# EAGLE schematic easy_bee_counter (EAGLE 9.4.2)
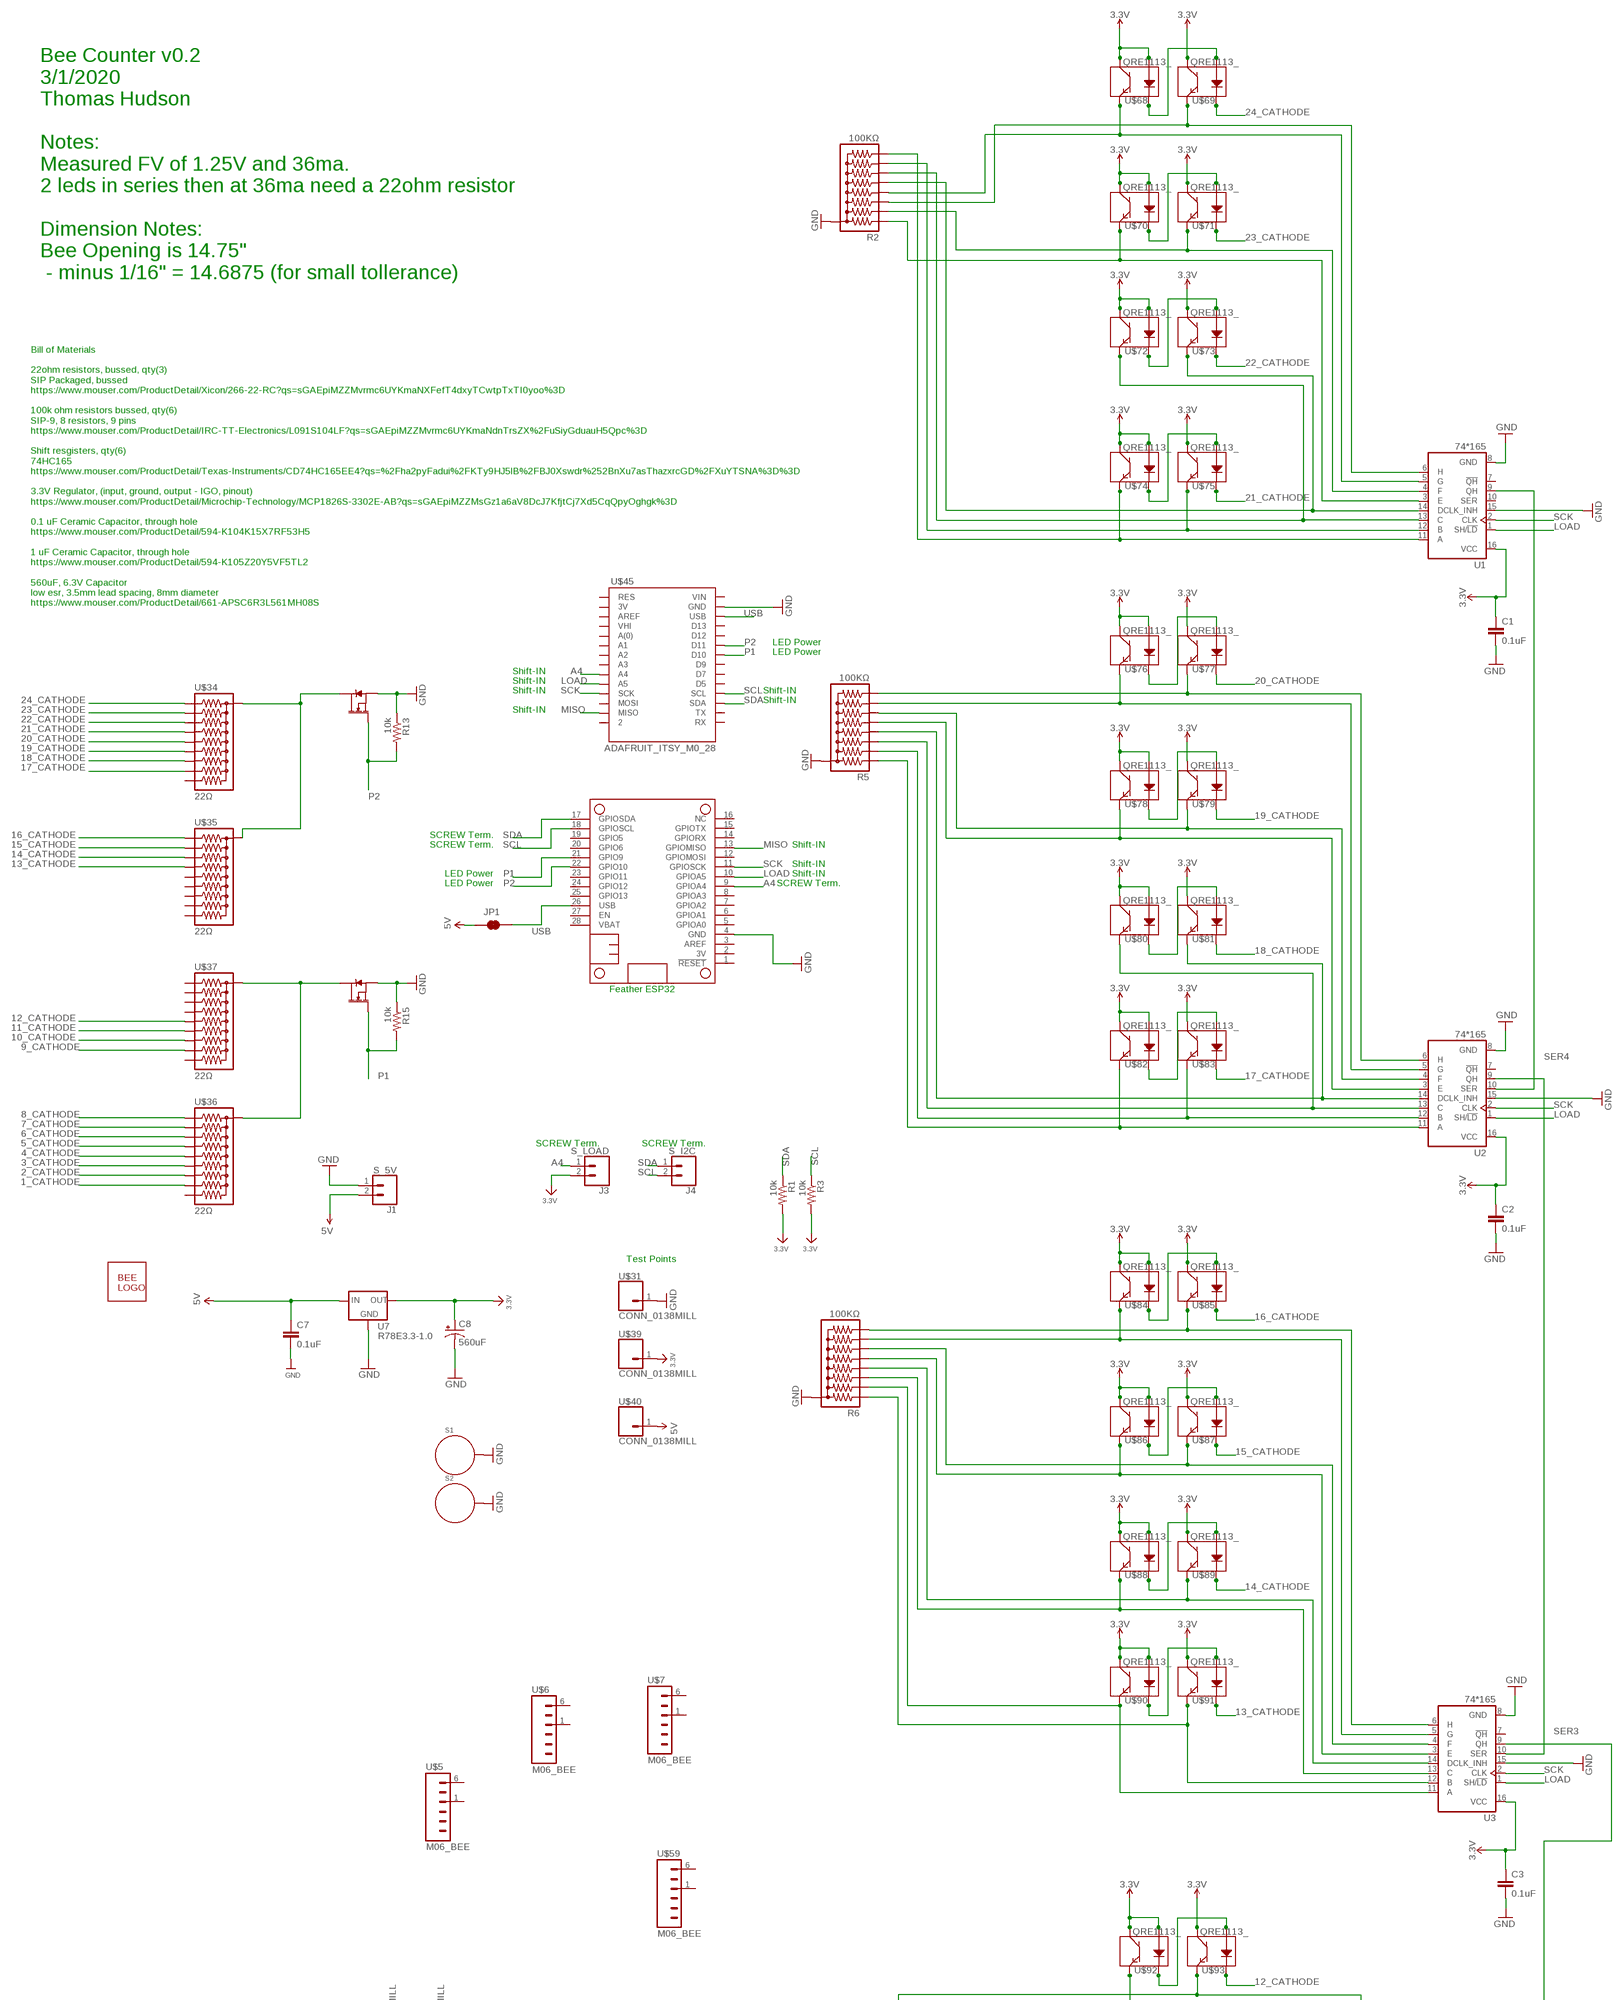
[diagram p0: schematic, sheet 1, part 1 of 2]
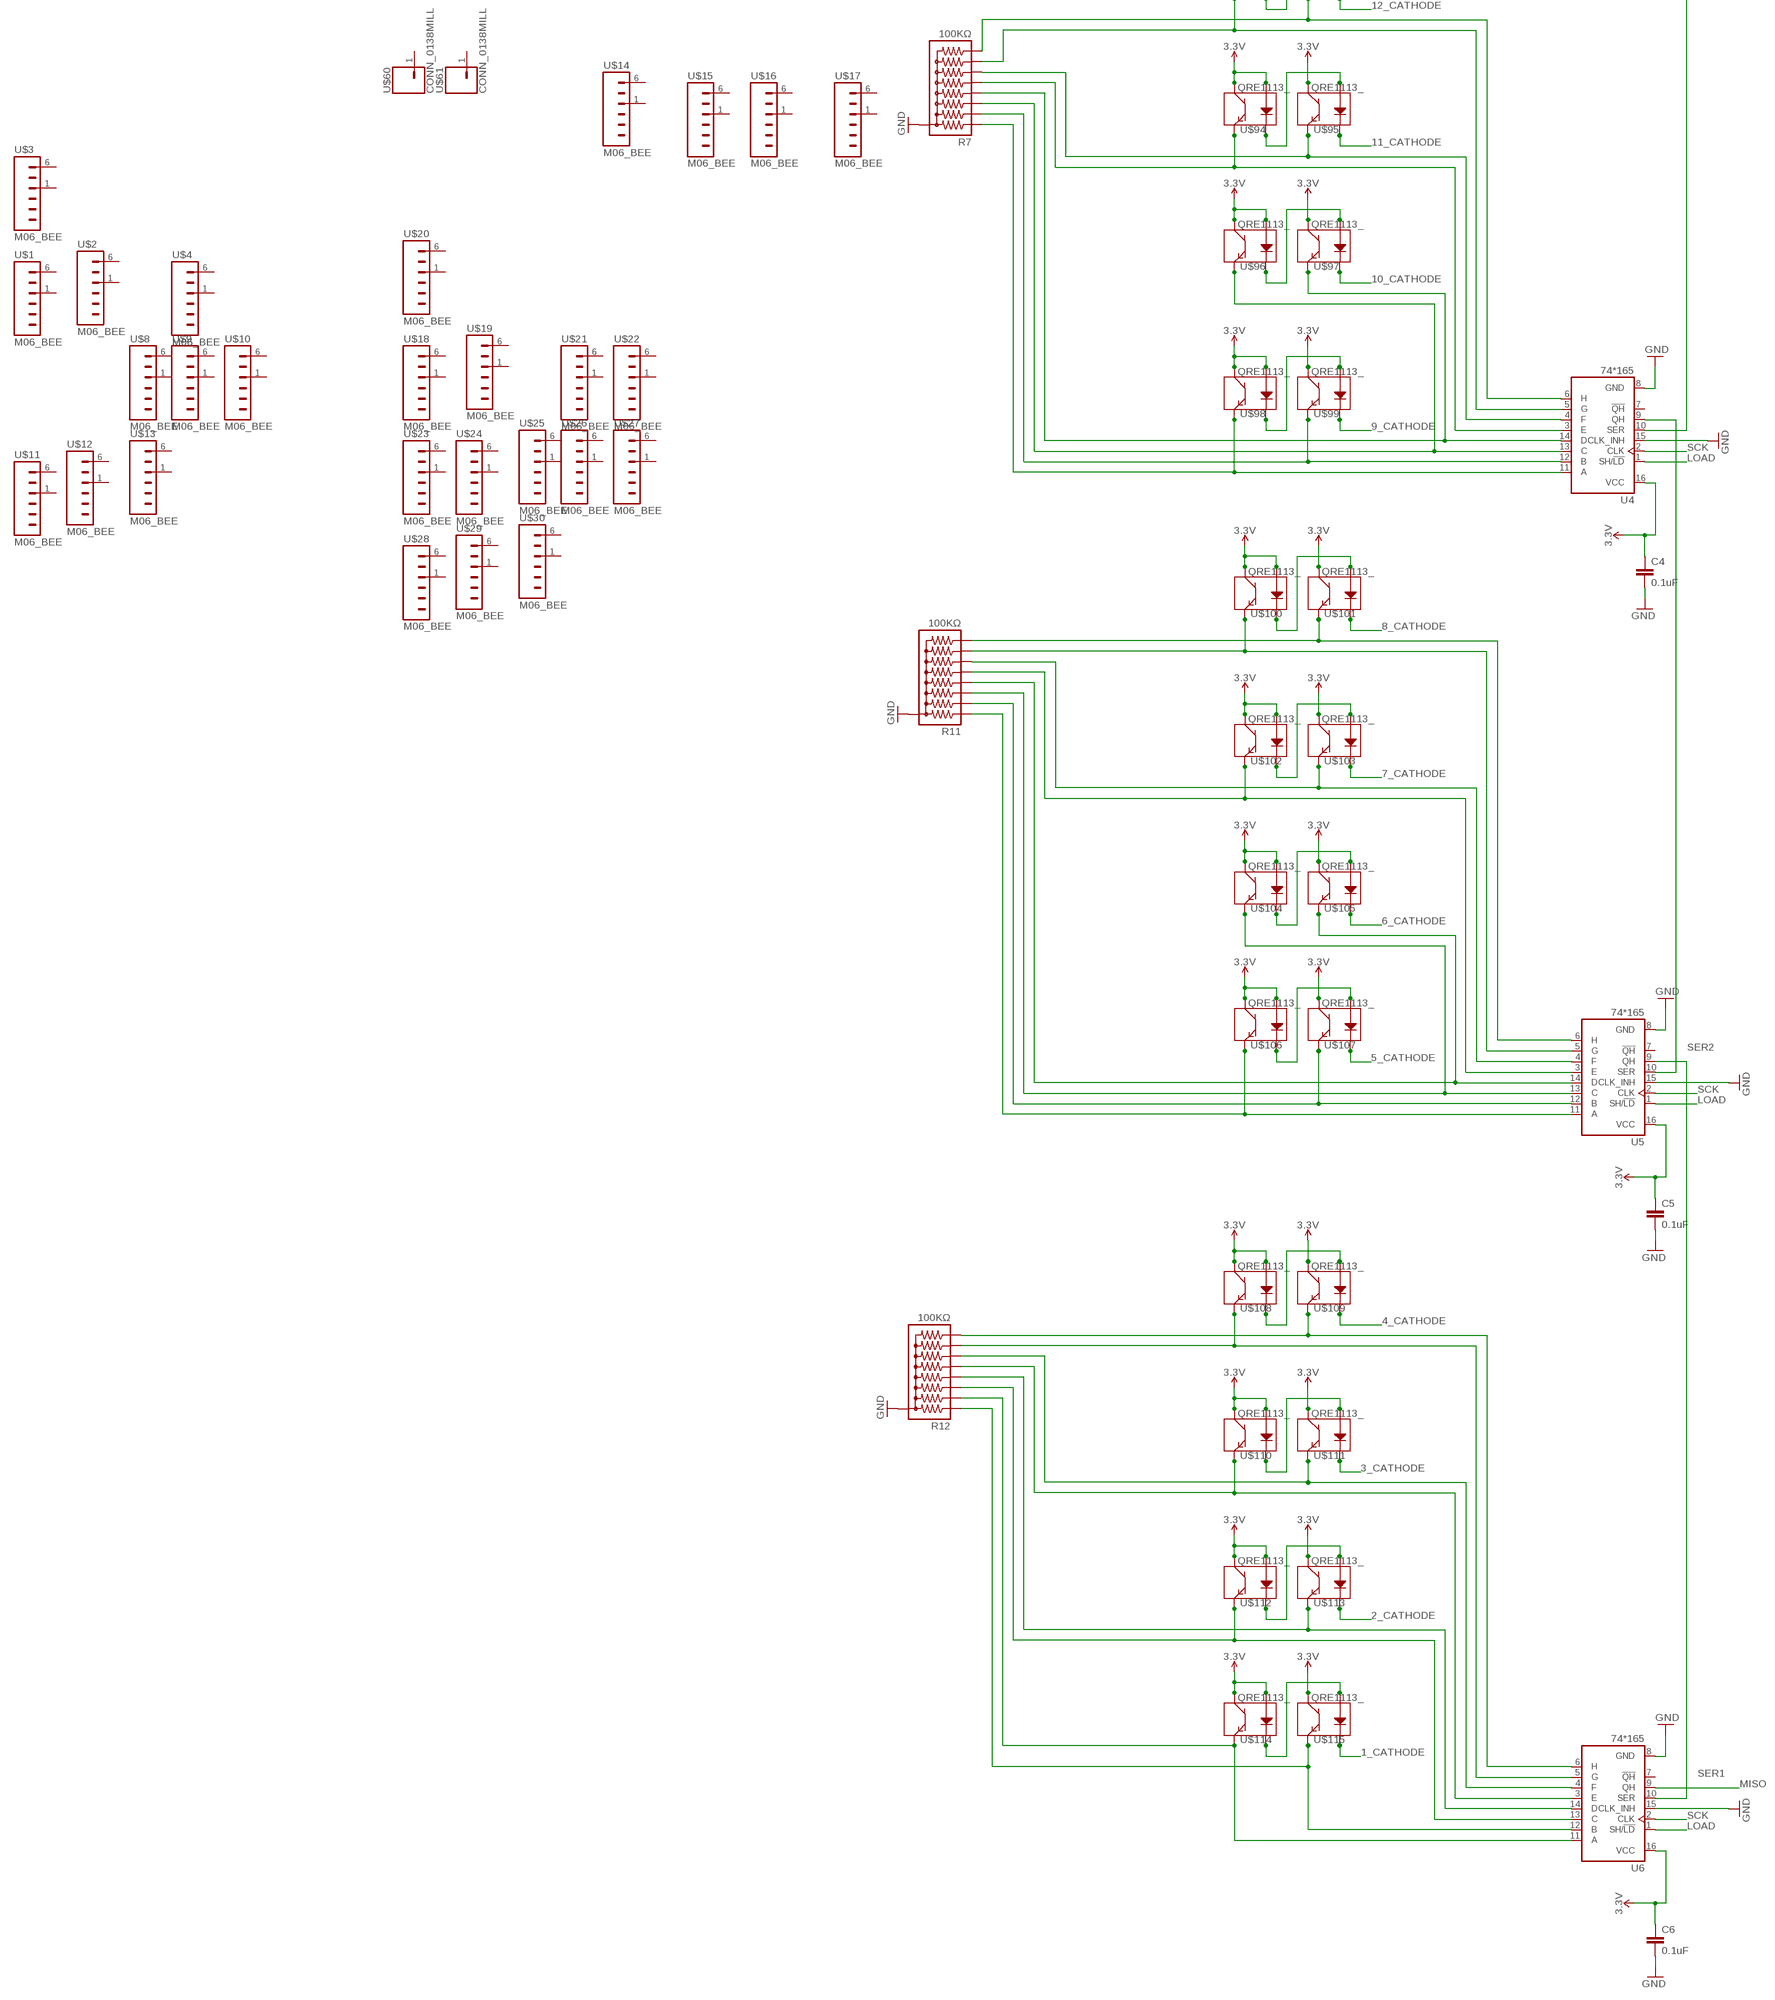
[diagram p1: schematic, sheet 1, part 2 of 2]

## Parts
C1  0.1uF  0.1UF-KIT-EZ-50V-20%  [CAP-PTH-SMALL-KIT]
C2  0.1uF  0.1UF-KIT-EZ-50V-20%  [CAP-PTH-SMALL-KIT]
C3  0.1uF  0.1UF-KIT-EZ-50V-20%  [CAP-PTH-SMALL-KIT]
C4  0.1uF  0.1UF-KIT-EZ-50V-20%  [CAP-PTH-SMALL-KIT]
C5  0.1uF  0.1UF-KIT-EZ-50V-20%  [CAP-PTH-SMALL-KIT]
C6  0.1uF  0.1UF-KIT-EZ-50V-20%  [CAP-PTH-SMALL-KIT]
C7  0.1uF  0.1UF-KIT-EZ-50V-20%  [CAP-PTH-SMALL-KIT]
C8  560uF  CPOL-USE3.5-8  [E3,5-8]
J1  S_5V  CONN_025MM  [SCREWTERMINAL-5MM-2]
J3  S_LOAD  CONN_025MM  [SCREWTERMINAL-5MM-2]
J4  S_I2C  CONN_025MM  [SCREWTERMINAL-5MM-2]
JP1  JUMPER-SMT_2_NC_TRACE_SILK  [SMT-JUMPER_2_NC_TRACE_SILK]
MS2  FEATHERWING_NODIM  [FEATHERWING_DIM]
Q6  60V/32A/35mΩ  MOSFET-NCH-FQP30N06L  [TO220V]
Q7  60V/32A/35mΩ  MOSFET-NCH-FQP30N06L  [TO220V]
R1  10k  RESISTORAXIAL-0.3  [AXIAL-0.3]
R2  100KΩ  RPACK-BUSSED-8-SIP-PTH-8  [RPACK-SIP-PTH-8]
R3  10k  RESISTORAXIAL-0.3  [AXIAL-0.3]
R5  100KΩ  RPACK-BUSSED-8-SIP-PTH-8  [RPACK-SIP-PTH-8]
R6  100KΩ  RPACK-BUSSED-8-SIP-PTH-8  [RPACK-SIP-PTH-8]
R7  100KΩ  RPACK-BUSSED-8-SIP-PTH-8  [RPACK-SIP-PTH-8]
R11  100KΩ  RPACK-BUSSED-8-SIP-PTH-8  [RPACK-SIP-PTH-8]
R12  100KΩ  RPACK-BUSSED-8-SIP-PTH-8  [RPACK-SIP-PTH-8]
R13  10k  RESISTORAXIAL-0.3  [AXIAL-0.3]
R15  10k  RESISTORAXIAL-0.3  [AXIAL-0.3]
S1  STANDOFF_ELECTRICAL5-32  [STANDOFF_ELECTRICAL_5_32]
S2  STANDOFF_ELECTRICAL5-32  [STANDOFF_ELECTRICAL_5_32]
U1  74*165  74165  [DIP16]
U2  74*165  74165  [DIP16]
U3  74*165  74165  [DIP16]
U4  74*165  74165  [DIP16]
U5  74*165  74165  [DIP16]
U6  74*165  74165  [DIP16]
U7  R78E3.3-1.0  R-78E5.0-1.0  [DC-DC_CONVERTER_78XX]
U$1  M06_BEE  [1X06_BEE]
U$2  M06_BEE  [1X06_BEE]
U$3  M06_BEE  [1X06_BEE]
U$4  M06_BEE  [1X06_BEE]
U$5  M06_BEE  [1X06_BEE]
U$6  M06_BEE  [1X06_BEE]
U$7  M06_BEE  [1X06_BEE]
U$8  M06_BEE  [1X06_BEE]
U$9  M06_BEE  [1X06_BEE]
U$10  M06_BEE  [1X06_BEE]
U$11  M06_BEE  [1X06_BEE]
U$12  M06_BEE  [1X06_BEE]
U$13  M06_BEE  [1X06_BEE]
U$14  M06_BEE  [1X06_BEE]
U$15  M06_BEE  [1X06_BEE]
U$16  M06_BEE  [1X06_BEE]
U$17  M06_BEE  [1X06_BEE]
U$18  M06_BEE  [1X06_BEE]
U$19  M06_BEE  [1X06_BEE]
U$20  M06_BEE  [1X06_BEE]
U$21  M06_BEE  [1X06_BEE]
U$22  M06_BEE  [1X06_BEE]
U$23  M06_BEE  [1X06_BEE]
U$24  M06_BEE  [1X06_BEE]
U$25  M06_BEE  [1X06_BEE]
U$26  M06_BEE  [1X06_BEE]
U$27  M06_BEE  [1X06_BEE]
U$28  M06_BEE  [1X06_BEE]
U$29  M06_BEE  [1X06_BEE]
U$30  M06_BEE  [1X06_BEE]
U$31  CONN_0138MILL  [1X01-40MILL]
U$34  22Ω  RPACK-BUSSED-9  [RPACK-SIP-PTH-9]
U$35  22Ω  RPACK-BUSSED-9  [RPACK-SIP-PTH-9]
U$36  22Ω  RPACK-BUSSED-9  [RPACK-SIP-PTH-9]
U$37  22Ω  RPACK-BUSSED-9  [RPACK-SIP-PTH-9]
U$39  CONN_0138MILL  [1X01-40MILL]
U$40  CONN_0138MILL  [1X01-40MILL]
U$44  BEE_LOGO  [BEE_LOGO]
U$45  ADAFRUIT_ITSY_M0_28  [ADAFRUIT_ITS_MO_28]
U$59  M06_BEE  [1X06_BEE]
U$60  CONN_0138MILL  [1X01-40MILL]
U$61  CONN_0138MILL  [1X01-40MILL]
U$68  QRE1113_  [DIP400W50P180L360H200Q4]
U$69  QRE1113_  [DIP400W50P180L360H200Q4]
U$70  QRE1113_  [DIP400W50P180L360H200Q4]
U$71  QRE1113_  [DIP400W50P180L360H200Q4]
U$72  QRE1113_  [DIP400W50P180L360H200Q4]
U$73  QRE1113_  [DIP400W50P180L360H200Q4]
U$74  QRE1113_  [DIP400W50P180L360H200Q4]
U$75  QRE1113_  [DIP400W50P180L360H200Q4]
U$76  QRE1113_  [DIP400W50P180L360H200Q4]
U$77  QRE1113_  [DIP400W50P180L360H200Q4]
U$78  QRE1113_  [DIP400W50P180L360H200Q4]
U$79  QRE1113_  [DIP400W50P180L360H200Q4]
U$80  QRE1113_  [DIP400W50P180L360H200Q4]
U$81  QRE1113_  [DIP400W50P180L360H200Q4]
U$82  QRE1113_  [DIP400W50P180L360H200Q4]
U$83  QRE1113_  [DIP400W50P180L360H200Q4]
U$84  QRE1113_  [DIP400W50P180L360H200Q4]
U$85  QRE1113_  [DIP400W50P180L360H200Q4]
U$86  QRE1113_  [DIP400W50P180L360H200Q4]
U$87  QRE1113_  [DIP400W50P180L360H200Q4]
U$88  QRE1113_  [DIP400W50P180L360H200Q4]
U$89  QRE1113_  [DIP400W50P180L360H200Q4]
U$90  QRE1113_  [DIP400W50P180L360H200Q4]
U$91  QRE1113_  [DIP400W50P180L360H200Q4]
U$92  QRE1113_  [DIP400W50P180L360H200Q4]
U$93  QRE1113_  [DIP400W50P180L360H200Q4]
U$94  QRE1113_  [DIP400W50P180L360H200Q4]
U$95  QRE1113_  [DIP400W50P180L360H200Q4]
U$96  QRE1113_  [DIP400W50P180L360H200Q4]
U$97  QRE1113_  [DIP400W50P180L360H200Q4]
U$98  QRE1113_  [DIP400W50P180L360H200Q4]
U$99  QRE1113_  [DIP400W50P180L360H200Q4]
U$100  QRE1113_  [DIP400W50P180L360H200Q4]
U$101  QRE1113_  [DIP400W50P180L360H200Q4]
U$102  QRE1113_  [DIP400W50P180L360H200Q4]
U$103  QRE1113_  [DIP400W50P180L360H200Q4]
U$104  QRE1113_  [DIP400W50P180L360H200Q4]
U$105  QRE1113_  [DIP400W50P180L360H200Q4]
U$106  QRE1113_  [DIP400W50P180L360H200Q4]
U$107  QRE1113_  [DIP400W50P180L360H200Q4]
U$108  QRE1113_  [DIP400W50P180L360H200Q4]
U$109  QRE1113_  [DIP400W50P180L360H200Q4]
U$110  QRE1113_  [DIP400W50P180L360H200Q4]
U$111  QRE1113_  [DIP400W50P180L360H200Q4]
U$112  QRE1113_  [DIP400W50P180L360H200Q4]
U$113  QRE1113_  [DIP400W50P180L360H200Q4]
U$114  QRE1113_  [DIP400W50P180L360H200Q4]
U$115  QRE1113_  [DIP400W50P180L360H200Q4]

## Nets
1_CATHODE: U$36.P$9 U$115.2(K)
2_CATHODE: U$36.P$8 U$113.2(K)
3.3V: C1.1 C2.1 C3.1 C4.1 C5.1 C6.1 C8.+ J3.2 R1.P$2 R3.P$2 U1.16(VCC) U2.16(VCC) U3.16(VCC) U4.16(VCC) U5.16(VCC) U6.16(VCC) U7.VOUT(OUT) U$39.1 U$68.1(A) U$68.3(C) U$69.3(C) U$70.1(A) U$70.3(C) U$71.3(C) U$72.1(A) U$72.3(C) U$73.3(C) U$74.1(A) U$74.3(C) U$75.3(C) U$76.1(A) U$76.3(C) U$77.3(C) U$78.1(A) U$78.3(C) U$79.3(C) U$80.1(A) U$80.3(C) U$81.3(C) U$82.1(A) U$82.3(C) U$83.3(C) U$84.1(A) U$84.3(C) U$85.3(C) U$86.1(A) U$86.3(C) U$87.3(C) U$88.1(A) U$88.3(C) U$89.3(C) U$90.1(A) U$90.3(C) U$91.3(C) U$92.1(A) U$92.3(C) U$93.3(C) U$94.1(A) U$94.3(C) U$95.3(C) U$96.1(A) U$96.3(C) U$97.3(C) U$98.1(A) U$98.3(C) U$99.3(C) U$100.1(A) U$100.3(C) U$101.3(C) U$102.1(A) U$102.3(C) U$103.3(C) U$104.1(A) U$104.3(C) U$105.3(C) U$106.1(A) U$106.3(C) U$107.3(C) U$108.1(A) U$108.3(C) U$109.3(C) U$110.1(A) U$110.3(C) U$111.3(C) U$112.1(A) U$112.3(C) U$113.3(C) U$114.1(A) U$114.3(C) U$115.3(C)
3_CATHODE: U$36.P$7 U$111.2(K)
4_CATHODE: U$36.P$6 U$109.2(K)
5_CATHODE: U$36.P$5 U$107.2(K)
5V: C7.1 J1.2 JP1.1 U7.VIN(IN) U$40.1
6_CATHODE: U$36.P$4 U$105.2(K)
7_CATHODE: U$36.P$3 U$103.2(K)
8_CATHODE: U$36.P$2 U$101.2(K)
9_CATHODE: U$37.P$9 U$99.2(K)
10_CATHODE: U$37.P$8 U$97.2(K)
11_CATHODE: U$37.P$7 U$95.2(K)
12_CATHODE: U$37.P$6 U$93.2(K)
13_CATHODE: U$35.P$5 U$91.2(K)
14_CATHODE: U$35.P$4 U$89.2(K)
15_CATHODE: U$35.P$3 U$87.2(K)
16_CATHODE: U$35.P$2 U$85.2(K)
17_CATHODE: U$34.P$9 U$83.2(K)
18_CATHODE: U$34.P$8 U$81.2(K)
19_CATHODE: U$34.P$7 U$79.2(K)
20_CATHODE: U$34.P$6 U$77.2(K)
21_CATHODE: U$34.P$5 U$75.2(K)
22_CATHODE: U$34.P$4 U$73.2(K)
23_CATHODE: U$34.P$3 U$71.2(K)
24_CATHODE: U$34.P$2 U$69.2(K)
A4: J3.1 MS2.9(GPIOA4) U$45.A4
GND: C1.2 C2.2 C3.2 C4.2 C5.2 C6.2 C7.2 C8.- J1.1 MS2.4(GND) Q6.3(S) Q7.3(S) R2.P$1 R5.P$1 R6.P$1 R7.P$1 R11.P$1 R12.P$1 R13.P$1 R15.P$1 S1.P1 S2.P1 U1.8(GND) U1.15(CLK_INH) U2.8(GND) U2.15(CLK_INH) U3.8(GND) U3.15(CLK_INH) U4.8(GND) U4.15(CLK_INH) U5.8(GND) U5.15(CLK_INH) U6.8(GND) U6.15(CLK_INH) U7.GND U$31.1 U$45.GND
LOAD: MS2.10(GPIOA5) U1.1(SH/!LD) U2.1(SH/!LD) U3.1(SH/!LD) U4.1(SH/!LD) U5.1(SH/!LD) U6.1(SH/!LD) U$45.A5
MISO: MS2.13(GPIOMISO) U6.9(QH) U$45.MISO
N$1: U$94.2(K) U$95.1(A)
N$2: U$92.2(K) U$93.1(A)
N$3: U$96.2(K) U$97.1(A)
N$4: U$98.2(K) U$99.1(A)
N$5: U$106.2(K) U$107.1(A)
N$6: U$104.2(K) U$105.1(A)
N$7: U$100.2(K) U$101.1(A)
N$8: U$108.2(K) U$109.1(A)
N$10: U$102.2(K) U$103.1(A)
N$11: U$110.2(K) U$111.1(A)
N$12: R5.P$9 U2.6(H) U$77.4(E)
N$13: U$112.2(K) U$113.1(A)
N$14: U$114.2(K) U$115.1(A)
N$15: R6.P$3 U3.11(A) U$90.4(E)
N$16: R6.P$2 U3.12(B) U$91.4(E)
N$17: R6.P$4 U3.13(C) U$88.4(E)
N$18: R12.P$6 U6.3(E) U$110.4(E)
N$19: R6.P$5 U3.14(D) U$89.4(E)
N$20: R6.P$8 U3.5(G) U$84.4(E)
N$21: Q6.2(D) U$34.P$1 U$35.P$1
N$22: R6.P$9 U3.6(H) U$85.4(E)
N$23: R6.P$6 U3.3(E) U$86.4(E)
N$24: R6.P$7 U3.4(F) U$87.4(E)
N$25: R5.P$4 U2.13(C) U$80.4(E)
N$26: R5.P$5 U2.14(D) U$81.4(E)
N$27: R5.P$8 U2.5(G) U$76.4(E)
N$28: U3.9(QH) U4.10(SER)
N$29: R5.P$6 U2.3(E) U$78.4(E)
N$30: R12.P$3 U6.11(A) U$114.4(E)
N$32: R5.P$7 U2.4(F) U$79.4(E)
N$33: R5.P$3 U2.12(B) U$83.4(E)
N$34: R7.P$4 U4.13(C) U$96.4(E)
N$35: R5.P$2 U2.11(A) U$82.4(E)
N$36: R2.P$7 U1.13(C) U$72.4(E)
N$37: R2.P$6 U1.14(D) U$73.4(E)
N$38: R2.P$5 U1.5(G) U$68.4(E)
N$39: R2.P$4 U1.6(H) U$69.4(E)
N$40: R2.P$2 U1.3(E) U$70.4(E)
N$41: R2.P$3 U1.4(F) U$71.4(E)
N$42: R2.P$8 U1.12(B) U$75.4(E)
N$43: R2.P$9 U1.11(A) U$74.4(E)
N$45: U$68.2(K) U$69.1(A)
N$46: U$70.2(K) U$71.1(A)
N$47: U$72.2(K) U$73.1(A)
N$48: U$74.2(K) U$75.1(A)
N$49: U$82.2(K) U$83.1(A)
N$50: U$80.2(K) U$81.1(A)
N$51: U$76.2(K) U$77.1(A)
N$52: U$78.2(K) U$79.1(A)
N$53: U$84.2(K) U$85.1(A)
N$54: U$86.2(K) U$87.1(A)
N$55: U$88.2(K) U$89.1(A)
N$56: U$90.2(K) U$91.1(A)
N$58: R12.P$7 U6.4(F) U$111.4(E)
N$62: R7.P$8 U4.5(G) U$92.4(E)
N$63: Q7.2(D) U$36.P$1 U$37.P$1
N$65: R7.P$6 U4.3(E) U$94.4(E)
N$68: R7.P$2 U4.11(A) U$98.4(E)
N$74: R11.P$3 U5.12(B) U$107.4(E)
N$87: R12.P$2 U6.12(B) U$115.4(E)
N$89: R11.P$4 U5.13(C) U$104.4(E)
N$91: R11.P$8 U5.5(G) U$100.4(E)
N$93: R11.P$6 U5.3(E) U$102.4(E)
N$97: R11.P$2 U5.11(A) U$106.4(E)
N$101: R12.P$4 U6.13(C) U$112.4(E)
N$102: R12.P$5 U6.14(D) U$113.4(E)
N$105: R11.P$5 U5.14(D) U$105.4(E)
N$108: R12.P$8 U6.5(G) U$108.4(E)
N$109: R12.P$9 U6.6(H) U$109.4(E)
N$112: R11.P$9 U5.6(H) U$101.4(E)
N$117: R11.P$7 U5.4(F) U$103.4(E)
N$131: R7.P$5 U4.14(D) U$97.4(E)
N$135: R7.P$9 U4.6(H) U$93.4(E)
N$140: R7.P$7 U4.4(F) U$95.4(E)
N$141: R7.P$3 U4.12(B) U$99.4(E)
P1: MS2.21(GPIO9) Q7.1(G) R15.P$2 U$45.D10
P2: MS2.22(GPIO10) Q6.1(G) R13.P$2 U$45.D11
SCK: MS2.11(GPIOSCK) U1.2(CLK) U2.2(CLK) U3.2(CLK) U4.2(CLK) U5.2(CLK) U6.2(CLK) U$45.SCK
SCL: J4.2 MS2.18(GPIOSCL) R3.P$1 U$45.SCL
SDA: J4.1 MS2.17(GPIOSDA) R1.P$1 U$45.SDA
SER1: U5.9(QH) U6.10(SER)
SER2: U4.9(QH) U5.10(SER)
SER3: U2.9(QH) U3.10(SER)
SER4: U1.9(QH) U2.10(SER)
USB: JP1.2 MS2.26(USB) U$45.USB
Unconnected: MS2.1(!RESET) MS2.2(3V) MS2.3(AREF) MS2.5(GPIOA0) MS2.6(GPIOA1) MS2.7(GPIOA2) MS2.8(GPIOA3) MS2.12(GPIOMOSI) MS2.14(GPIORX) MS2.15(GPIOTX) MS2.16(NC) MS2.19(GPIO5) MS2.20(GPIO6) MS2.23(GPIO11) MS2.24(GPIO12) MS2.25(GPIO13) MS2.27(EN) MS2.28(VBAT) U1.7(!QH) U1.10(SER) U2.7(!QH) U3.7(!QH) U4.7(!QH) U5.7(!QH) U6.7(!QH) U$1.1 U$1.6 U$2.1 U$2.6 U$3.1 U$3.6 U$4.1 U$4.6 U$5.1 U$5.6 U$6.1 U$6.6 U$7.1 U$7.6 U$8.1 U$8.6 U$9.1 U$9.6 U$10.1 U$10.6 U$11.1 U$11.6 U$12.1 U$12.6 U$13.1 U$13.6 U$14.1 U$14.6 U$15.1 U$15.6 U$16.1 U$16.6 U$17.1 U$17.6 U$18.1 U$18.6 U$19.1 U$19.6 U$20.1 U$20.6 U$21.1 U$21.6 U$22.1 U$22.6 U$23.1 U$23.6 U$24.1 U$24.6 U$25.1 U$25.6 U$26.1 U$26.6 U$27.1 U$27.6 U$28.1 U$28.6 U$29.1 U$29.6 U$30.1 U$30.6 U$34.P$10 U$35.P$6 U$35.P$7 U$35.P$8 U$35.P$9 U$35.P$10 U$36.P$10 U$37.P$2 U$37.P$3 U$37.P$4 U$37.P$5 U$37.P$10 U$45.2 U$45.3V U$45.A0(A(0)) U$45.A1 U$45.A2 U$45.A3 U$45.AREF U$45.D5 U$45.D7 U$45.D9 U$45.D12 U$45.D13 U$45.MOSI U$45.RES U$45.RX U$45.TX U$45.VHI U$45.VIN U$59.1 U$59.6 U$60.1 U$61.1

## Notes on the sheet
- Bee Counter v0.2
  3/1/2020
  Thomas Hudson
- Notes:
  Measured FV of 1.25V and 36ma.
  2 leds in series then at 36ma need a 22ohm resistor
  
  Dimension Notes:
  Bee Opening is 14.75"
   - minus 1/16" = 14.6875 (for small tollerance)
- Bill of Materials
  
  22ohm resistors, bussed, qty(3)
  SIP Packaged, bussed
  https://www.mouser.com/ProductDetail/Xicon/266-22-RC?qs=sGAEpiMZZMvrmc6UYKmaNXFefT4dxyTCwtpTxTI0yoo%3D
  
  100k ohm resistors bussed, qty(6)
  SIP-9, 8 resistors, 9 pins
  https://www.mouser.com/ProductDetail/IRC-TT-Electronics/L091S104LF?qs=sGAEpiMZZMvrmc6UYKmaNdnTrsZX%2FuSiyGduauH5Qpc%3D
  
  Shift resgisters, qty(6)
  74HC165
  https://www.mouser.com/ProductDetail/Texas-Instruments/CD74HC165EE4?qs=%2Fha2pyFadui%2FKTy9HJ5lB%2FBJ0Xswdr%252BnXu7asThazxrcGD%2FXuYTSNA%3D%3D
  
  3.3V Regulator, (input, ground, output - IGO, pinout)
  https://www.mouser.com/ProductDetail/Microchip-Technology/MCP1826S-3302E-AB?qs=sGAEpiMZZMsGz1a6aV8DcJ7KfjtCj7Xd5CqQpyOghgk%3D
  
  0.1 uF Ceramic Capacitor, through hole
  https://www.mouser.com/ProductDetail/594-K104K15X7RF53H5
  
  1 uF Ceramic Capacitor, through hole
  https://www.mouser.com/ProductDetail/594-K105Z20Y5VF5TL2
  
  560uF, 6.3V Capacitor
  low esr, 3.5mm lead spacing, 8mm diameter
  https://www.mouser.com/ProductDetail/661-APSC6R3L561MH08S
- LED Power
- LED Power
- Shift-IN
- Shift-IN
- Shift-IN | Shift-IN
- Shift-IN
- Shift-IN
- SCREW Term.
- SCREW Term. | Shift-IN
- Shift-IN
- LED Power | Shift-IN
- LED Power | SCREW Term.
- Feather ESP32
- SCREW Term. | SCREW Term.
- Test Points

## Library data of the parts
C1-C7 = SparkFun-Capacitors:0.1UF: 0.1µF ceramic capacitors A capacitor is a passive two-terminal electrical component used to store electrical energy temporarily in an electric field.; PROD_ID: CAP-08370
C8 = rcl:CPOL-US: POLARIZED CAPACITOR, American symbol; SPICEPREFIX: C
J1 J3 J4 = SparkFun-Connectors:CONN_02: Multi connection point. Often used as Generic Header-pin footprint for 0.1 inch spaced/style header connections On any of the 0.1 inch spaced packages, you can populate with these: Break Away Headers - Straight <https://www.sparkfun.com/products/116> (PRT-00116) Break Away Male Headers - Right Angle <https://www.sparkfun.com/products/553> (PRT-00553) Female Headers <https://www.sparkfun.com/products/115> (PRT-00115) Break Away Headers - Machine Pin <https://www.sparkfun.com/products/117> (PRT-00117) Break Away Female Headers - Swiss Machine Pin <https://www.sparkfun.com/products/743> (PRT-00743) For SCREWTERMINALS and SPRING TERMINALS visit here: Screw Terimnals on SparkFun.com <https://www.sparkfun.com/search/results?term=Screw+Terminals> (5mm/3.5mm/2.54mm spacing) This device is also useful as a general connection point to wire up your design to another part of your project. Our various solder wires solder well into these plated through hole pads. Hook-Up Wire - Assortment (Stranded, 22 AWG) <https://www.sparkfun.com/products/11375> (PRT-11375) Hook-Up Wire - Assortment (Solid Core, 22 AWG) <https://www.sparkfun.com/products/11367> (PRT-11367) View the entire wire category on our website here <https://www.sparkfun.com/categories/141> Special notes: Molex polarized connector foot print use with: PRT-08233 with associated crimp pins and housings. 2.54_SCREWTERM for use with PRT-10571. 3.5mm Screw Terminal footprints for PRT-08084 5mm Screw Terminal footprints for use with PRT-08432; SF_SKU: PRT-08432
JP1 = SparkFun-Jumpers:JUMPER-SMT_2_NC_TRACE: Normally closed trace jumper This jumper has a trace between two pads so it's normally closed (NC). Use a razor knife to open the connection. For best results follow the IPC guidelines for cutting traces: Cutout at least 0.063 mm (0.005 in). Remove all loose material to clean up the cut area. Seal the cut with an approved epoxy. Reapply solder to reclose the connection.
MS2 = th_libraries:FEATHERWING
Q6 Q7 = th_libraries:MOSFET-NCH: N-channel MOSFETs Voltage controlled devices that allow control of high current outputs. SparkFun Products: SparkFun OpenScale <https://www.sparkfun.com/products/13261> SparkFun Digital Sandbox <https://www.sparkfun.com/products/12651> SparkFun Monster Moto Shield <https://www.sparkfun.com/products/10182> SparkFun MOSFET Power Controller <https://www.sparkfun.com/products/11214>; PROD_ID: TRANS-10060
R1 R3 R13 R15 = SparkFun-Passives:RESISTOR: Resistor Basic schematic elements and footprints for 0603, 1206, and PTH resistors.
R2 R5-R7 R11 R12 = th_libraries:RPACK-BUSSED-8: BOURNS 4600X/R series thick-film SIP resistor packs Height resistors bussed to a single pin (denoted by dot). datasheet <http://dlnmh9ip6v2uc.cloudfront.net/datasheets/Components/General/4600x.pdf> SIMILAR TO: SFE parts COM-10855 (330), COM-10856 (10K)
S1 S2 = th_libraries:STANDOFF_ELECTRICAL: A standoff intended to be an electrically connected point. Pad size and stop size allow for a #8 Phillips pan screw head to make a solid connection to the board. Added 144mill drill hole that fits my normal wood screw
U1-U6 = th_libraries:74*165: 8-Bit Shift Register (Parallel to Serial) Datasheet <https://cdn.sparkfun.com/datasheets/BreakoutBoards/sn54hc165.pdf> SparkFun Products SparkFun Shift-In Breakout - SN74HC165 <https://www.sparkfun.com/products/11733> (BOB-11733)
U7 = SparkFun-IC-Power:R-78E5.0-1.0: Recom Power 5V 1A DC/DC Converter The Recom R-78E5.0-X.X is a compact DC/DC converter module that is a pin for pin drop-in replacement for the LM7805 linear voltage regulator. Specifications: Input Range: 7-28V Output Voltage: 5V Output Current: 1A Max Efficiency: 91% Datasheet <https://www.recom-power.com/pdf/Innoline/R-78Exx-1.0.pdf>; PROD_ID: COM-13655
U$1-U$30 U$59 = Bee Counter 3:M06_BEE
U$31 U$39 U$40 U$60 U$61 = th_libraries3:CONN_01
U$34-U$37 = th_libraries:RPACK-BUSSED-9: used in easy bee 10pins, 9 resistors, common buss Bourns https://www.mouser.com/ProductDetail/Bourns/4610X-101-220LF?qs=sGAEpiMZZMvrmc6UYKmaNVMVEQDzqD4WvYds4mFxwCY%3D Xicon https://www.mouser.com/ProductDetail/Xicon/266-22-RC?qs=sGAEpiMZZMvrmc6UYKmaNXFefT4dxyTCwtpTxTI0yoo%3D
U$44 = owen_desktop:BEE_LOGO
U$45 = easy_bee_counter:ADAFRUIT_ITSY_M0_28
U$68-U$115 = QRE1113:QRE1113_: Reflective object sensor

## Net classes
1 gnd: width 0.635 mm, drill 0.635 mm, clearance 0.254 mm
2 vcc: width 0.406 mm, drill 0.406 mm, clearance 0.254 mm